# Altium schematic sheet High_Voltage.SchDoc
size A4
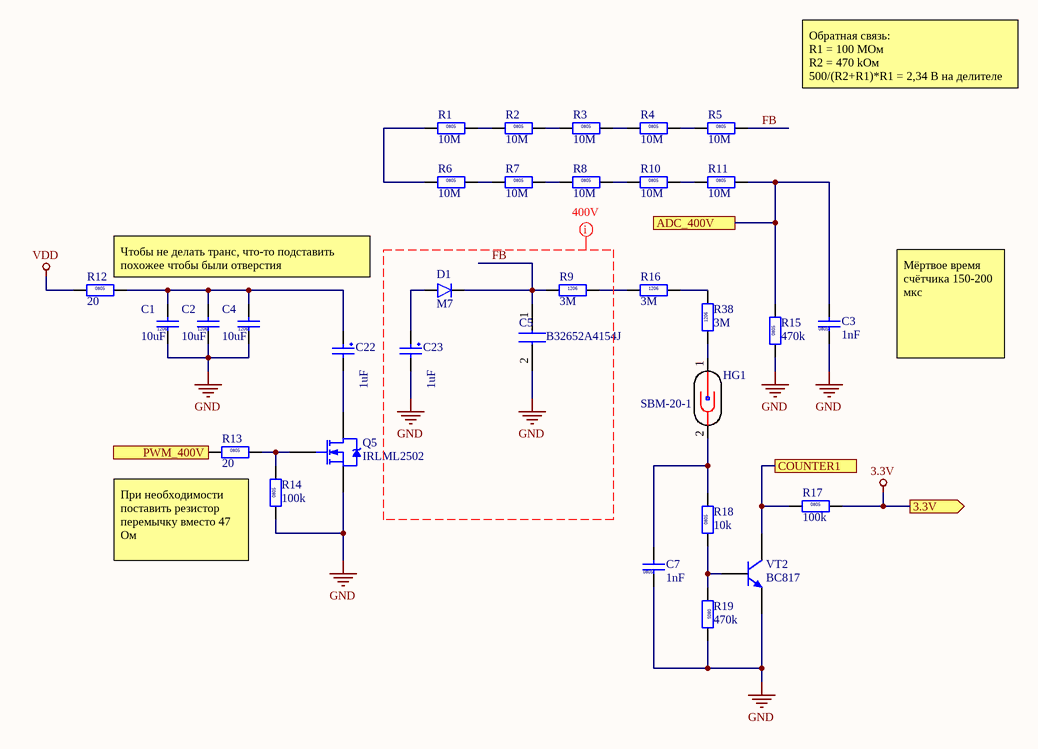
[diagram p0: High_Voltage.SchDoc]

## Parts
C1  value 10uF  [CAPC3216-1206L]  (hidden comment: CAPC_1206)
C2  value 10uF  [CAPC3216-1206L]  (hidden comment: CAPC_1206)
C3  value 1nF  [CAPC2012-0805M]  (hidden comment: CAPC_0805)
C4  value 10uF  [CAPC3216-1206L]  (hidden comment: CAPC_1206)
C5  B32652A4154J  [B32652A4154J]
C7  value 1nF  [CAPC2012-0805M]  (hidden comment: CAPC_0805)
C22  value 1uF  [ECAP811.5]  (hidden comment: ECAP-811.5)
C23  value 1uF  [ECAP16315]  (hidden comment: ECAP-1625)
D1  M7  [DIOM5026X262N]
HG1  SBM-20-1  [SBM-20-1]
Q5  IRLML2502  [SOT23-3L]
R1  value 10M  [RESC2012-0805M]  (hidden comment: RESC_0805_R)
R2  value 10M  [RESC2012-0805M]  (hidden comment: RESC_0805_R)
R3  value 10M  [RESC2012-0805M]  (hidden comment: RESC_0805_R)
R4  value 10M  [RESC2012-0805M]  (hidden comment: RESC_0805_R)
R5  value 10M  [RESC2012-0805M]  (hidden comment: RESC_0805_R)
R6  value 10M  [RESC2012-0805M]  (hidden comment: RESC_0805_R)
R7  value 10M  [RESC2012-0805M]  (hidden comment: RESC_0805_R)
R8  value 10M  [RESC2012-0805M]  (hidden comment: RESC_0805_R)
R9  value 3M  [RESC3216-1206M]  (hidden comment: RESC_1206_R)
R10  value 10M  [RESC2012-0805M]  (hidden comment: RESC_0805_R)
R11  value 10M  [RESC2012-0805M]  (hidden comment: RESC_0805_R)
R12  value 20  [RESC2012-0805M]  (hidden comment: RESC_0805_R)
R13  value 20  [RESC2012-0805M]  (hidden comment: RESC_0805_R)
R14  value 100k  [RESC2012-0805M]  (hidden comment: RESC_0805_R)
R15  value 470k  [RESC2012-0805M]  (hidden comment: RESC_0805_R)
R16  value 3M  [RESC3216-1206M]  (hidden comment: RESC_1206_R)
R17  value 100k  [RESC2012-0805M]  (hidden comment: RESC_0805_R)
R18  value 10k  [RESC2012-0805M]  (hidden comment: RESC_0805_R)
R19  value 470k  [RESC2012-0805M]  (hidden comment: RESC_0805_R)
R38  value 3M  [RESC3216-1206M]  (hidden comment: RESC_1206_R)
VT2  BC817  [SOT23-3M]

## Ports
3.3V (out), ADC_400V, COUNTER1, PWM_400V

## Nets
3.3V: R17.2 ; port 3.3V
GND: C1.1 C2.1 C3.1 C4.1 C5.2 C7.1 C23.2 Q5.2(S) R14.1 R15.1 R19.2 VT2.2(E)
VDD: R12.1
ADC_400V: C3.2 R11.2 R15.2 ; port ADC_400V
COUNTER1: R17.1 VT2.3(C) ; port COUNTER1
FB: C5.1 D1.1(K) R5.2 R9.1
PWM_400V: R13.1 ; port PWM_400V
NetC1_2: C1.2 C2.2 C4.2 C22.1 R12.2
NetC7_2: C7.2 HG1.2(K) R18.2
NetC22_2: C22.2 Q5.3(D)
NetC23_1: C23.1 D1.2(A)
NetHG1_1: HG1.1(A) R38.1
NetQ5_1: Q5.1(G) R13.2 R14.2
NetR1_1: R1.1 R6.1
NetR1_2: R1.2 R2.1
NetR2_2: R2.2 R3.1
NetR3_2: R3.2 R4.1
NetR4_2: R4.2 R5.1
NetR6_2: R6.2 R7.1
NetR7_2: R7.2 R8.1
NetR8_2: R8.2 R10.1
NetR9_2: R9.2 R16.1
NetR10_2: R10.2 R11.1
NetR16_2: R16.2 R38.2
NetR18_1: R18.1 R19.1 VT2.1(B)

## Layout directives
net class 400V: FB, GND

## Notes on the sheet
- Обратная связь:
  R1 = 100 МОм
  R2 = 470 kОм
  500/(R2+R1)*R1 = 2,34 В на делителе
- (near R12) Чтобы не делать транс, что-то подставить похожее чтобы были отверстия
- Мёртвое время счётчика 150-200 мкс
- При необходимости поставить резистор перемычку вместо 47 Ом
- (in symbol CAPC_0805) 0805
- (in symbol CAPC_1206) 1206
- (in symbol RESC_0805_R) 0805
- (in symbol RESC_1206_R) 1206

## Library data of the parts
C1 C2 C4 = CAPC_1206: Capacitor 1206
C3 C7 = CAPC_0805: Capacitor 0805
C5 = B32652A4154J: Capacitor; Manufacturer_Name: EPCOS; Datasheet Link: https://componentsearchengine.com/Datasheets/1/B32652A4154J.pdf; Height: 18mm; Manufacturer_Part_Number: B32652A4154J; Mouser Part Number: 871-B32652A4154J; Mouser Price/Stock: https://www.mouser.com/Search/Refine.aspx?Keyword=871-B32652A4154J
C22 = ECAP-811.5: Capacitor electrolytic 3.5 mm pitch, 8*11.5 body
C23 = ECAP-1625: Capacitor electrolytic 7.5 mm pitch, 16*25 body
D1 = M7: Diode; Manufacturer_Name: MULTICOMP; Manufacturer_Part_Number: SS34A; Datasheet Link: https://componentsearchengine.com/Datasheets/2/SS34A.pdf; Height: 2.62mm
Q5 = IRLML2502: IRLML2502 Hexfet power MOSFET
R1-R8 R10-R15 R17-R19 = RESC_0805_R: Resistor 0805
R9 R16 R38 = RESC_1206_R: Resistor 1206
VT2 = BC817: BC817 NPN Transistor